# EAGLE design IMU_BRB_v2 (EAGLE 8.3.2)
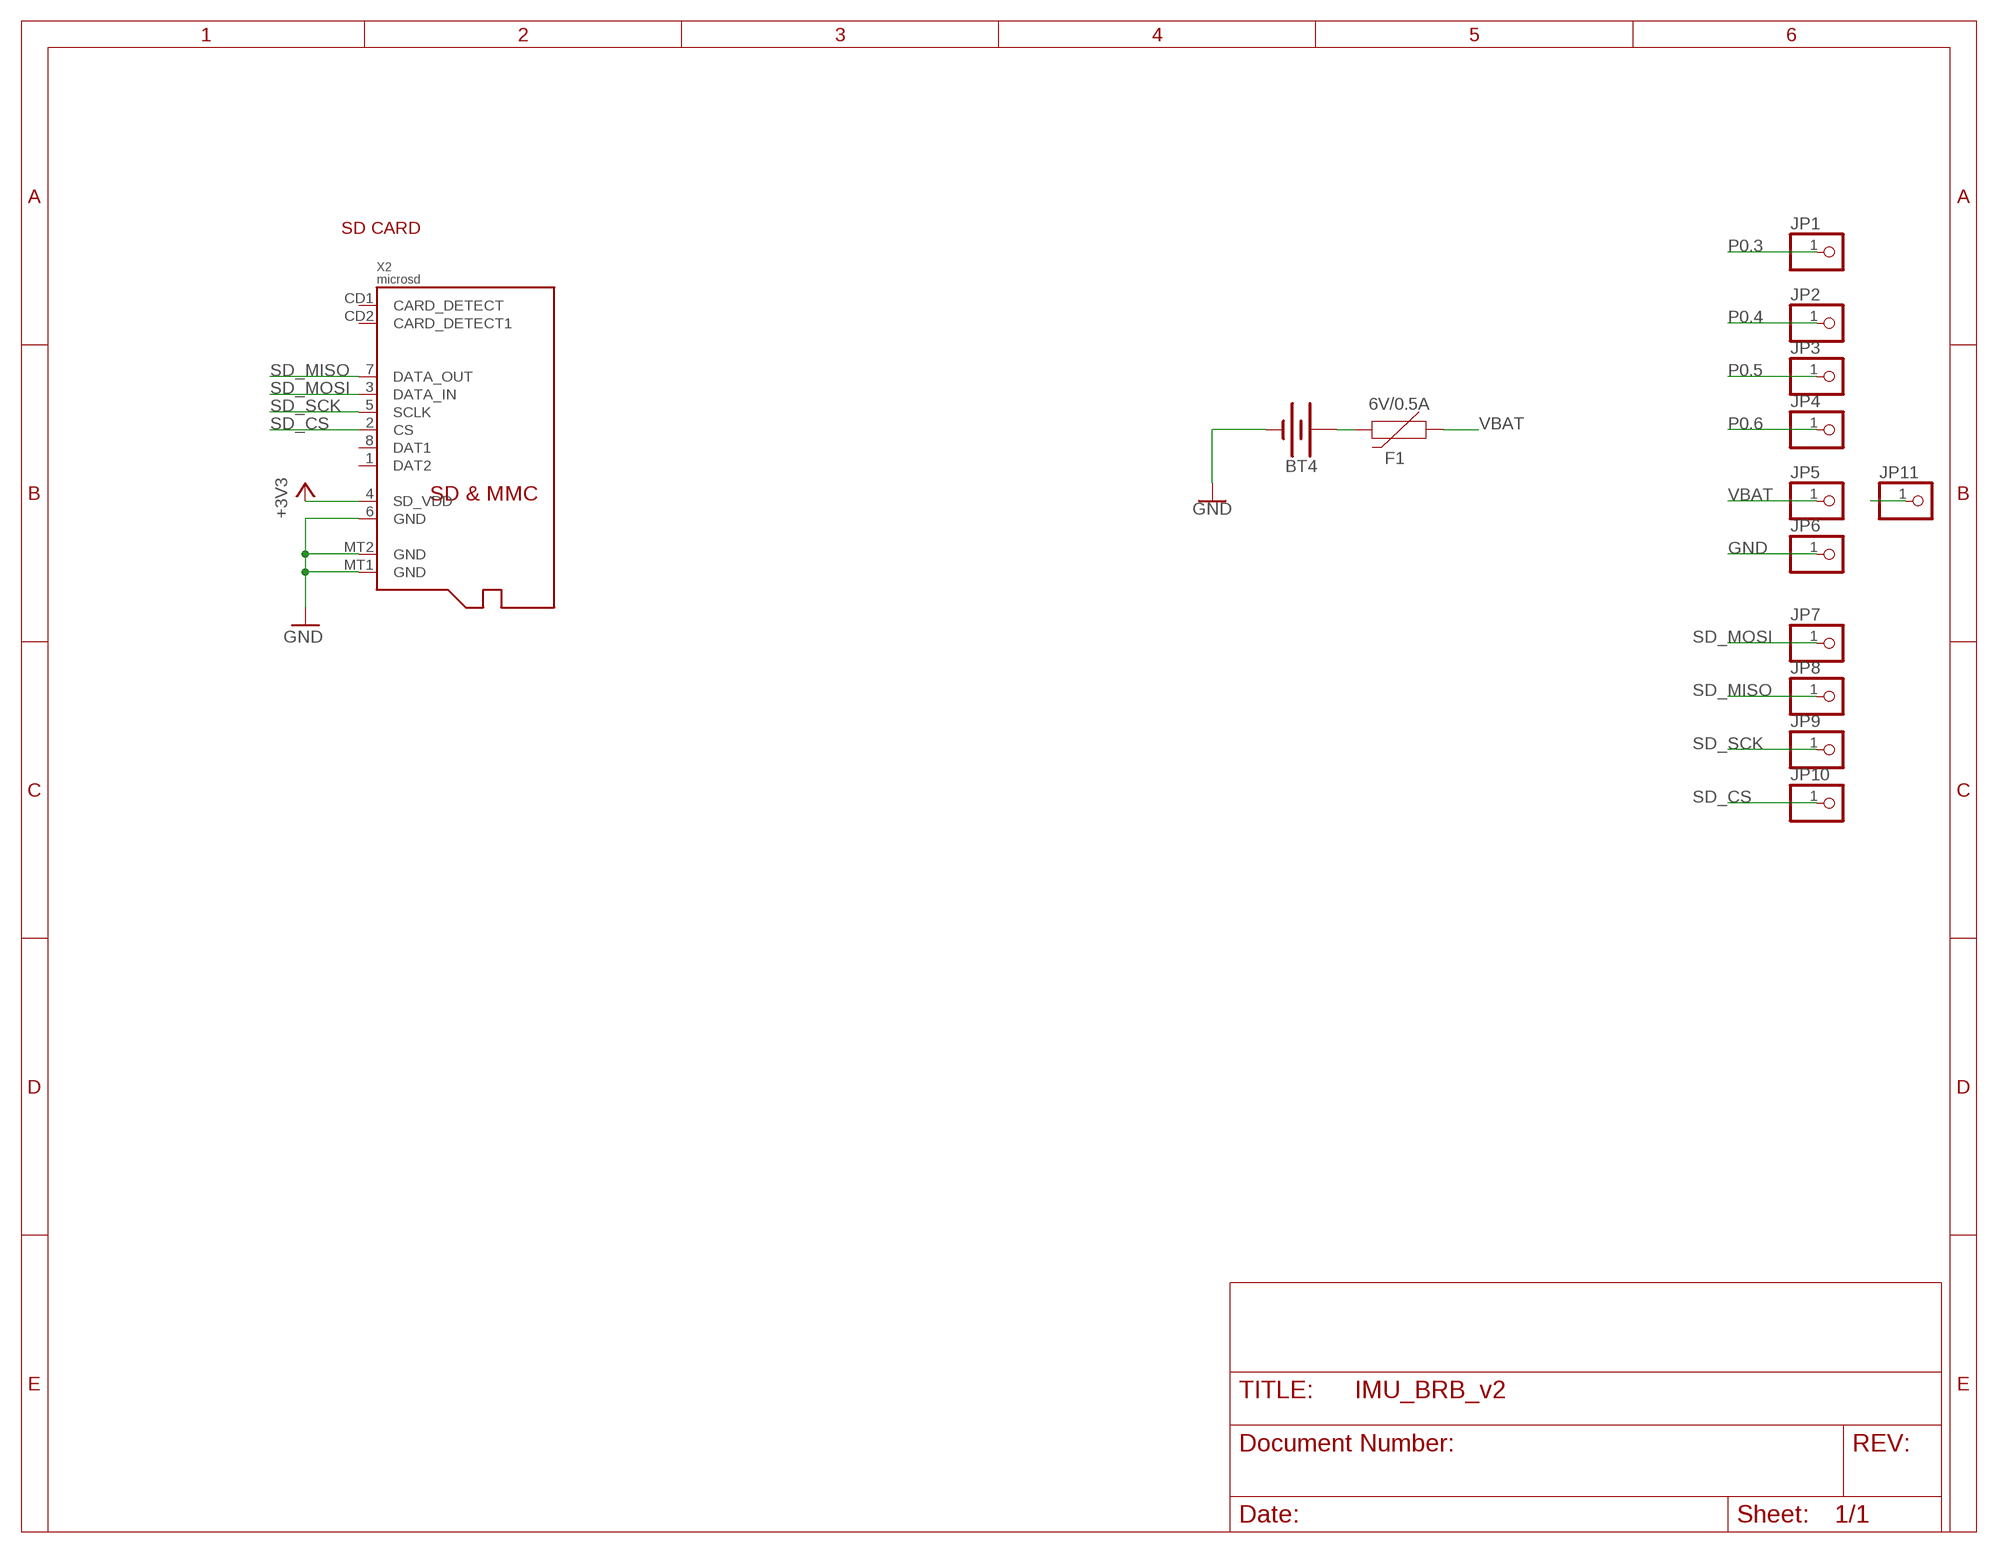
[diagram p0: schematic, sheet 1]

## Parts
BT4  BATTERY-20MM_SMD_4LEGS  [BATTCON_20MM_4LEGS]
F1  6V/0.5A  PPTC_HALF-AMP  [1206]
JP1  PINHD-1X1  [1X01]
JP2  PINHD-1X1  [1X01]
JP3  PINHD-1X1  [1X01]
JP4  PINHD-1X1  [1X01]
JP5  PINHD-1X1  [1X01]
JP6  PINHD-1X1  [1X01]
JP7  PINHD-1X1  [1X01]
JP8  PINHD-1X1  [1X01]
JP9  PINHD-1X1  [1X01]
JP10  PINHD-1X1  [1X01]
JP11  PINHD-1X1  [1X01]
X2  microsd  MICROSD  [MICROSD]

## Nets
3V3: JP11.1 X2.4(SD_VDD) ; supply symbol labelled +3V3
GND: BT4.NEGATIVE(-) JP6.1 X2.6(GND) X2.MT1(GND) X2.MT2(GND)
N$4: BT4.POSITIVE@1(+) BT4.POSITIVE@2(+) BT4.POSITIVE@3(+) BT4.POSITIVE@4(+) F1.2
P0.3: JP1.1
P0.4: JP2.1
P0.5: JP3.1
P0.6: JP4.1
SD_CS: JP10.1 X2.2(CS)
SD_MISO: JP8.1 X2.7(DATA_OUT)
SD_MOSI: JP7.1 X2.3(DATA_IN)
SD_SCK: JP9.1 X2.5(SCLK)
VBAT: F1.1 JP5.1
Unconnected: X2.1(DAT2) X2.8(DAT1) X2.CD1(CARD_DETECT) X2.CD2(CARD_DETECT1)

## Notes on the sheet
- SD CARD

## Library data of the parts
BT4 = SparkFun-Batteries:BATTERY: Battery - Single Cell A variety of battery chemistries, sizes, and footprints. Device List: 20MM_PTH - Coin Cell Battery Holder - 20mm (PTH) <https://www.sparkfun.com/products/783> 6.8MM_PTH - Coin Cell Battery Holder - 6.8MM(SMD) <https://www.digikey.com/product-detail/en/seiko-instruments/MS621FE-FL11E/728-1057-ND/1889208?WT.srch=1&gclid=CNOQ5a6LzdQCFZS2wAodXCkE0g> 12MM_SMD - Coin Cell Battery Holder - 12mm (SMD) <https://www.sparkfun.com/products/10592> 12MM_PTH - Coin Cell Battery Holder - 12mm (PTH) <https://www.sparkfun.com/products/7948> 20MM_SMD - 20mm Coin Cell Battery Holder (SMD) (2 legs) Used on the Big Time Watch Kit <https://www.sparkfun.com/products/11734> 20MM_SMD_4LEGS - Coin Cell Battery Holder - 20mm (SMD) <https://www.sparkfun.com/products/11892> 20MM_SMD_4LEGS_OVERPASTE - Coin Cell Battery Holder - 20mm (SMD) <https://www.sparkfun.com/products/11892> (Over-paste on the legs) 24.5MM_PTH - Coin Cell Battery Holder - 24.5mm (PTH) <https://www.sparkfun.com/products/8863> 9V - 9V Battery Holder - PC Mount Used on the SparkFun SparkPunk Sound Kit <https://www.sparkfun.com/products/11177> and SparkFun SparkPunk Sequencer Kit <https://www.sparkfun.com/products/12707> 18650 - Battery Holder - 18650 (PTH) <https://www.sparkfun.com/products/13113> AA - Battery Holder - 1xAA (PTH) <https://www.sparkfun.com/products/7949> AAA - Battery Holder - 1xAAA (PTH) <https://www.sparkfun.com/products/12718> AA_KIT - Battery Holder - 1xAA (PTH) <https://www.sparkfun.com/products/7949> Special kit package - pads only have exposed copper on one side of the board. AAA_KIT - Battery Holder - 1xAAA (PTH) <https://www.sparkfun.com/products/12718> Special kit package - pads only have exposed copper on one side of the board.; PROD_ID: BATT-10373; SF_SKU: PRT-11892
F1 = SparkFun-Fuses:PPTC: Resettable Fuse PPTC Resettable Fuse. Really a sort of resistor with a polymeric positive temperature coefficient whose resistance increases dramatically with an increase in temperature. When heated by the power passing through the resistance rises causing the current to be limited, protecting the circuit. This is achieved by the transition of the polymer from a crystalline to an amorphous state where the conductive carbon separates breaking the conductive pathways found in the cool crystalline structure. When a PPTC cools back down it resumes conducting letting the circuit turn back on. SparkFun Products: SparkFun RedBoard - Programmed with Arduino <https://www.sparkfun.com/products/12757> Pro Micro - 5V/16MHz <https://www.sparkfun.com/products/12640> Arduino Pro 328 - 5V/16MHz <https://www.sparkfun.com/products/10915> MP3 Trigger <https://www.sparkfun.com/products/13720>; PROD_ID: RES-08585
JP1-JP11 = pinhead:PINHD-1X1: PIN HEADER
X2 = microbuilder:MICROSD: MicroSD/Transflash Card Holder with SPI pinout 3M: 2908-05WB-MG 4UConnector: 19656 Footprint courtesy: Adafruit Industries

## Board
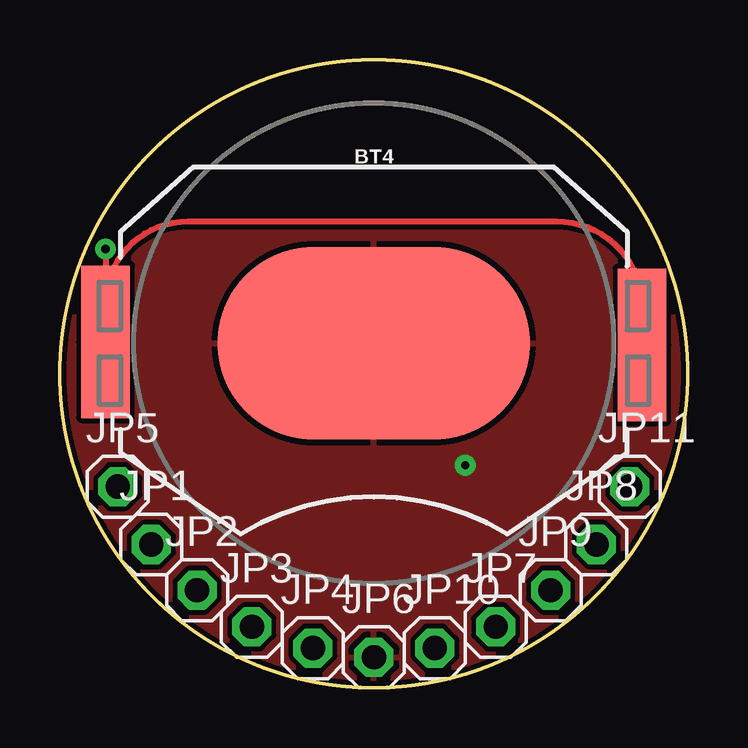
[diagram p1: board, top side]
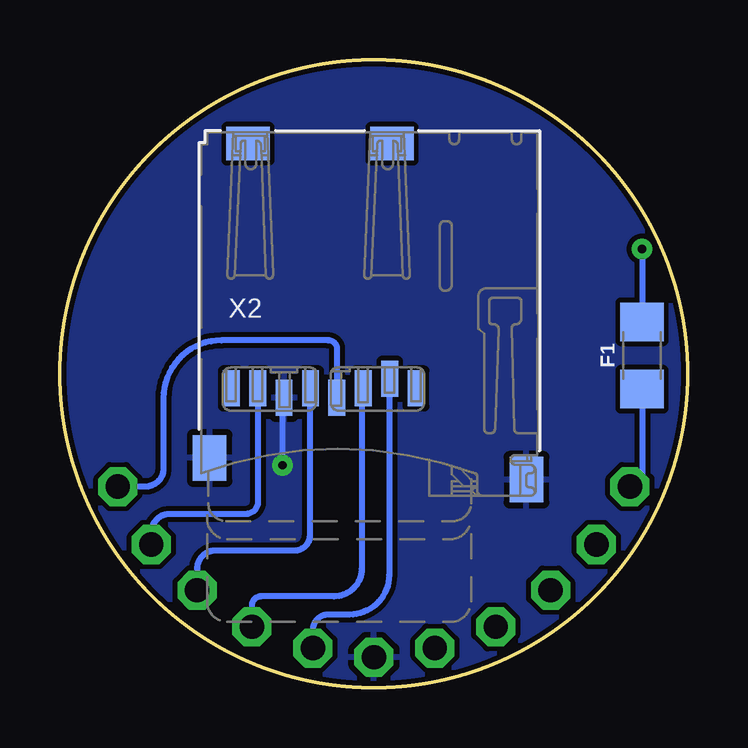
[diagram p2: board, bottom side, seen from below]

Size 26.15 x 26.15 mm. Coordinates in mm from the lower left corner, seen from the top.
Outline: circle at 13.08,13.08 radius 13.08
Copper layers (1*16): Top 0.035mm / dielectric 1.5mm / Bottom 0.035mm
Design rules "SparkFun": minimum track width 8mil, minimum drill 20mil, track to track 8mil, track to pad 8mil, pad to pad 8mil, via to via 8mil, smd to smd 8mil, copper to edge 8mil, drill to drill 8mil, minimum pad ring 12mil, minimum via ring 10mil, stop-mask expansion 4mil, vias tented up to drill 20mil, thermal gap 10mil

### Footprints (pad centres in the part's own frame; a part is rotated, then mirrored left to right if it is on the bottom)
BATTCON_20MM_4LEGS = smd 13 x 8: NEGATIVE 0,0 | smd 2.032 x 3.175: POSITIVE@1 -11.176,1.651; POSITIVE@2 -11.176,-1.524; POSITIVE@3 11.176,1.524; POSITIVE@4 11.176,-1.651
1206 = smd 1.6 x 1.8: 1 -1.4,0; 2 1.4,0
1X01 = drill 1.016 octagon: 1 0,0
MICROSD = smd 0.7 x 1.5: 1 9,-10.64; 2 7.9,-10.24; 3 6.8,-10.64; 4 5.7,-11.04; 5 4.6,-10.64; 6 3.5,-11.04; 7 2.4,-10.64; 8 1.3,-10.64 | smd 1.8 x 1.4: CD1 2,-0.44; CD2 8,-0.44 | smd 1.4 x 1.9: MT1 0.4,-13.54; MT2 13.6,-14.44

### Placement (x,y rotation side)
BT4  13.08,14.35 0 top
F1  1.9,13.84 90 bottom
JP1  3.8,5.96 0 top
JP2  5.71,4.06 0 top
JP3  8,2.53 0 top
JP4  10.54,1.65 0 top
JP5  2.41,8.38 0 top
JP6  13.08,1.26 0 top
JP7  18.16,2.53 0 top
JP8  22.35,5.96 0 top
JP9  20.44,4.06 0 top
JP10  15.62,1.65 0 top
JP11  23.74,8.38 0 top
X2  20.31,23.11 0 bottom

### Tracks (layer width: path | path; a pad name or v marks a point on that pad's centre or on a via)
3V3
  Bottom 0.254: X2.4 arc-90 14.6,12.08 14.6,14.09 arc-90 14.98,14.47 19.43,14.47 arc-90 21.84,12.06 21.84,9.14 arc90 22.6,8.38 JP11.1
GND  (via drill 0.35)
  Bottom 0.254: X2.6 arc-90 16.89,12 v16.89,9.27
  pour Top: -3.43,29.59 29.59,29.59 29.59,-3.43 -3.43,-3.43
  pour Bottom: -3.43,29.59 29.59,29.59 29.59,-3.43 -3.43,-3.43
N$4  (via drill 0.35)
  Top 0.254: v1.9,18.28 BT4.POSITIVE@1 | BT4.POSITIVE@2 BT4.POSITIVE@1 | BT4.POSITIVE@1 arc-90 5.33,19.43 20.7,19.43 arc-90 BT4.POSITIVE@3 BT4.POSITIVE@4
  Bottom 0.254: v1.9,18.28 F1.2
SD_CS
  Bottom 0.254: X2.2 arc-90 12.44,12.84 12.44,4.69 arc90 14.09,3.04 14.98,3.04 arc-90 15.62,2.41 JP10.1
SD_MISO
  Bottom 0.254: X2.7 arc90 17.9,12.46 17.9,7.74 arc90 18.41,7.23 21.58,7.23 arc-90 22.35,6.47 JP8.1
SD_MOSI
  Bottom 0.254: X2.3 arc-90 13.58,12.4 13.58,4.95 arc90 14.73,3.8 17.77,3.8 arc-90 18.16,3.42 JP7.1
SD_SCK
  Bottom 0.254: X2.5 arc-90 15.74,12.44 15.74,6.34 arc90 16.38,5.71 19.68,5.71 arc-90 20.44,4.95 JP9.1
VBAT
  Bottom 0.254: F1.1 1.9,8.88 arc90 JP5.1